# Altium schematic sheet 32-178原理图（源文件格式） - 副本.SchDoc
size A4
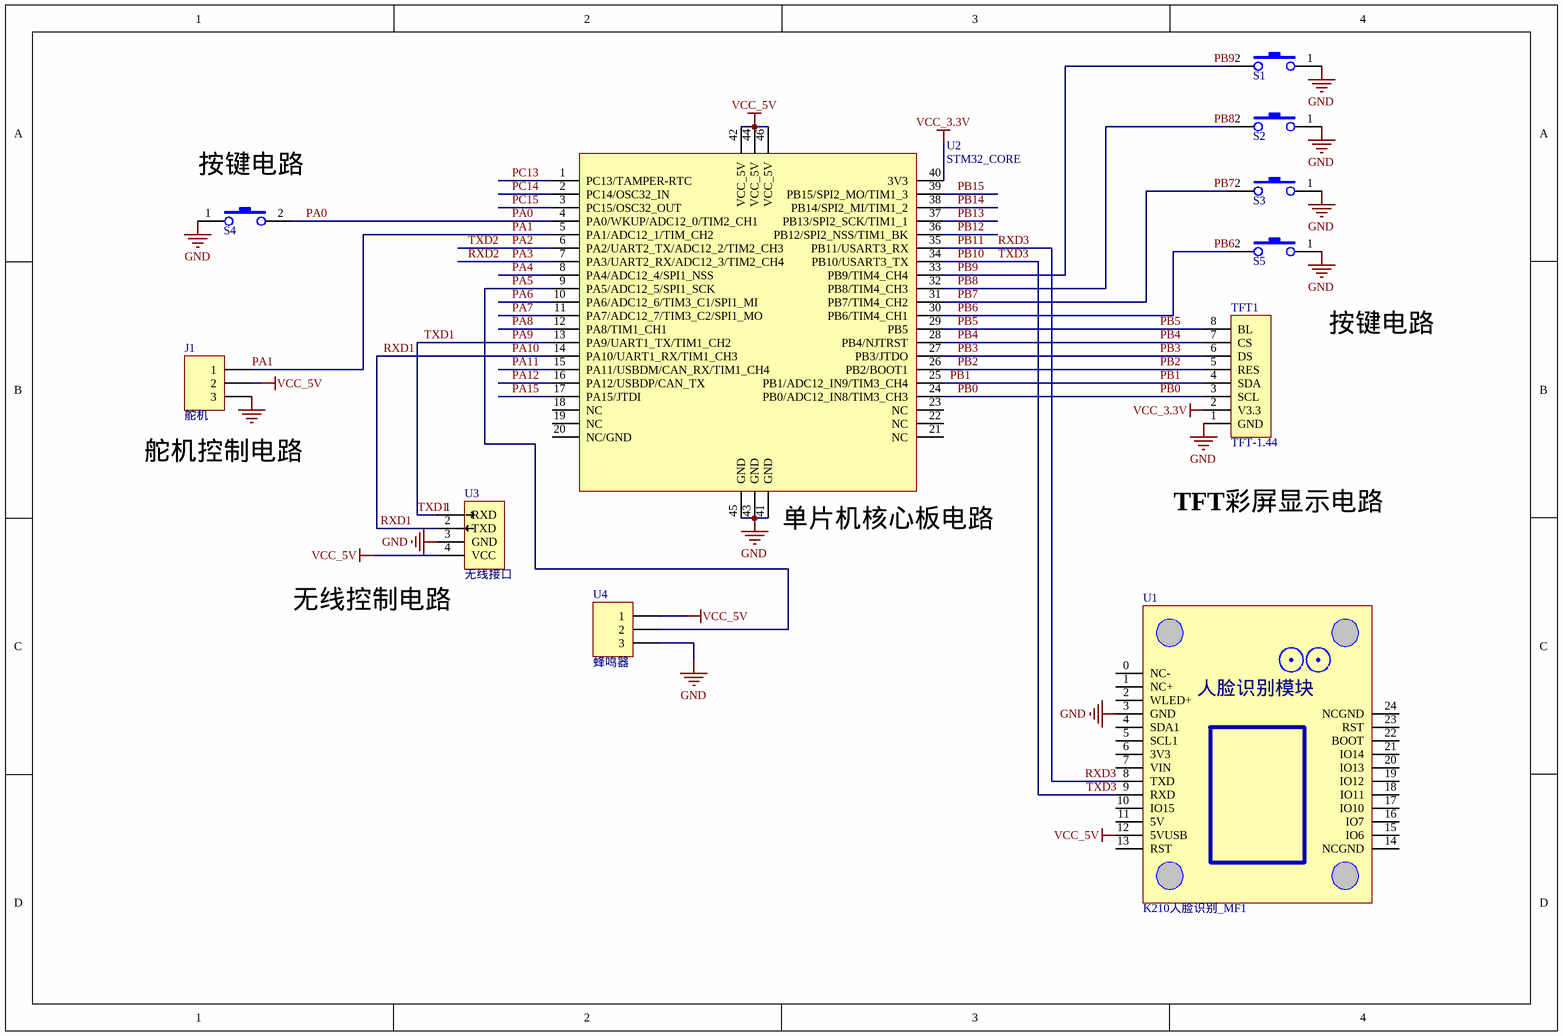
[diagram p0: 32-178原理图（源文件格式） - 副本.SchDoc]

## Parts
J1  舵机  [舵机接口]
S1  Button  [BUTTON_6x6DIP]  (value not drawn)
S2  Button  [BUTTON_6x6DIP]  (value not drawn)
S3  Button  [BUTTON_6x6DIP]  (value not drawn)
S4  Button  [BUTTON_6x6DIP]  (value not drawn)
S5  Button  [BUTTON_6x6DIP]  (value not drawn)
TFT1  TFT-1.44  [TFT-1.44]
U1  K210人脸识别_MF1  [K210_MF1]
U2  STM32_CORE  [STM32_CORE]
U3  无线接口  [蓝牙MODE平放]
U4  蜂鸣器  [舵机接口]

## Nets
GND: J1.3 S1.1 S2.1 S3.1 S4.1 S5.1 TFT1.1(GND) U1.3(GND) U2.41(GND) U2.43(GND) U2.45(GND) U3.3(GND) U4.3
VCC_3.3V: TFT1.2(V3.3) U2.40(3V3)
VCC_5V: J1.2 U1.12(5VUSB) U2.42(VCC_5V) U2.44(VCC_5V) U2.46(VCC_5V) U3.4(VCC) U4.1
PA0: S4.2 U2.4(PA0/WKUP/ADC12_0/TIM2_CH1)
PA1: J1.1 U2.5(PA1/ADC12_1/TIM_CH2)
PA2: U2.6(PA2/UART2_TX/ADC12_2/TIM2_CH3)  [also labelled TXD2]
PA3: U2.7(PA3/UART2_RX/ADC12_3/TIM2_CH4)  [also labelled RXD2]
PA4: U2.8(PA4/ADC12_4/SPI1_NSS)
PA5: U2.9(PA5/ADC12_5/SPI1_SCK) U4.2
PA6: U2.10(PA6/ADC12_6/TIM3_C1/SPI1_MI)
PA7: U2.11(PA7/ADC12_7/TIM3_C2/SPI1_MO)
PA8: U2.12(PA8/TIM1_CH1)
PA9: U2.13(PA9/UART1_TX/TIM1_CH2) U3.1(RXD)  [also labelled TXD1]
PA10: U2.14(PA10/UART1_RX/TIM1_CH3) U3.2(TXD)  [also labelled RXD1]
PA11: U2.15(PA11/USBDM/CAN_RX/TIM1_CH4)
PA12: U2.16(PA12/USBDP/CAN_TX)
PA15: U2.17(PA15/JTDI)
PB0: TFT1.3(SCL) U2.24(PB0/ADC12_IN8/TIM3_CH3)
PB1: TFT1.4(SDA) U2.25(PB1/ADC12_IN9/TIM3_CH4)
PB2: TFT1.5(RES) U2.26(PB2/BOOT1)
PB3: TFT1.6(DS) U2.27(PB3/JTDO)
PB4: TFT1.7(CS) U2.28(PB4/NJTRST)
PB5: TFT1.8(BL) U2.29(PB5)
PB6: S5.2 U2.30(PB6/TIM4_CH1)
PB7: S3.2 U2.31(PB7/TIM4_CH2)
PB8: S2.2 U2.32(PB8/TIM4_CH3)
PB9: S1.2 U2.33(PB9/TIM4_CH4)
PB10: U1.9(RXD) U2.34(PB10/USART3_TX)  [also labelled TXD3]
PB11: U1.8(TXD) U2.35(PB11/USART3_RX)  [also labelled RXD3]
PB12: U2.36(PB12/SPI2_NSS/TIM1_BK)
PB13: U2.37(PB13/SPI2_SCK/TIM1_1)
PB14: U2.38(PB14/SPI2_MI/TIM1_2)
PB15: U2.39(PB15/SPI2_MO/TIM1_3)
PC13: U2.1(PC13/TAMPER-RTC)
PC14: U2.2(PC14/OSC32_IN)
PC15: U2.3(PC15/OSC32_OUT)

Not connected (* = marked no-connect by the designer): U1 0(NC-) 1(NC+) 2(WLED+) 4(SDA1) 5(SCL1) 6(3V3) 7(VIN) 10(IO15) 11(5V) 13(RST) 14(NCGND) 15(IO6) 16(IO7) 17(IO10) 18(IO11) 19(IO12) 20(IO13) 21(IO14) 22(BOOT) 23(RST) 24(NCGND); U2 18(NC) 19(NC) 20(NC/GND) 21(NC) 22(NC) 23(NC)

## Notes on the sheet
- (near S4) 按键电路
- 按键电路
- (near J1) 舵机控制电路
- TFT彩屏显示电路
- (near U2) 单片机核心板电路
- 无线控制电路
- (in symbol K210人脸识别_MF1) 人脸识别模块

## Library data of the parts
J1 U4 = CON3: 接线端子3芯; LatestRevisionDate: 17-Jul-2002; LatestRevisionNote: Re-released for DXP Platform.; Publisher: Altium Limited
S1-S5 = Button: 按键
U2 = STM32_CORE: STM32核心板
U3 = 蓝牙MODE: 蓝牙模块